# Altium project AJAXProject.PrjPcb
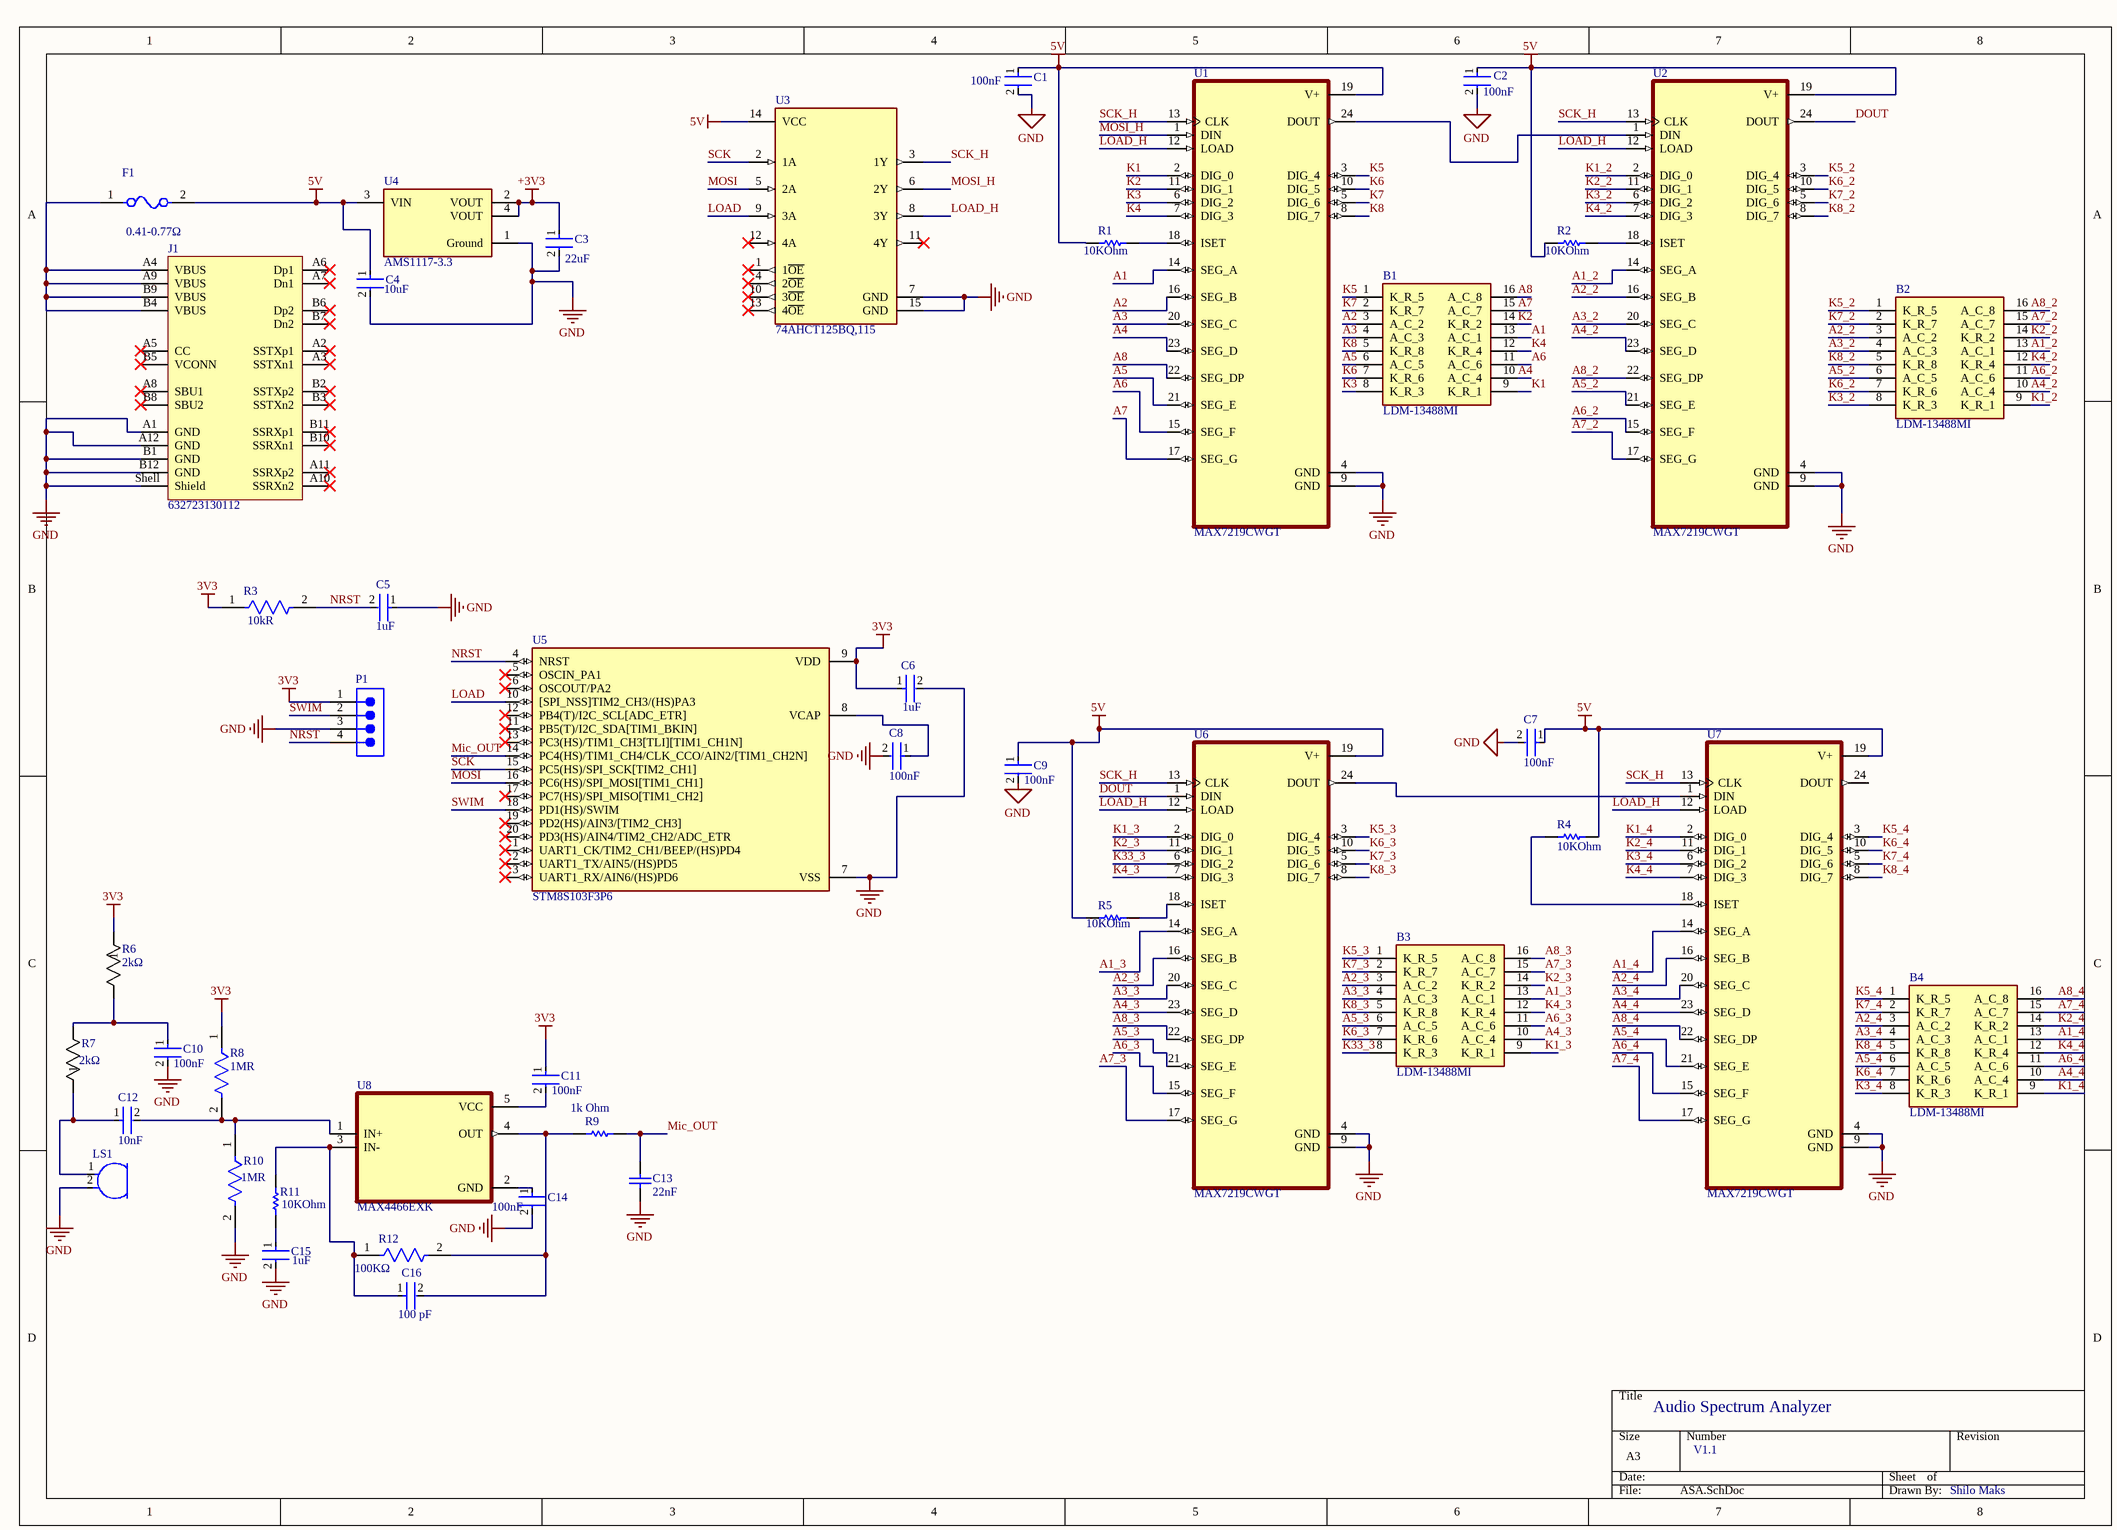
[diagram p0: ASA.SchDoc]
1 sheet, 44 parts. Net scope: global (net labels, ports and power ports of the same name join across sheets).

## Sheet ASA.SchDoc
size A3; SheetNumber: 1; SheetTotal: 1

### Parts
B1  LDM-13488MI  [LDM13488MI]
B2  LDM-13488MI  [LDM13488MI]
B3  LDM-13488MI  [LDM13488MI]
B4  LDM-13488MI  [LDM13488MI]
C1  Capacitance: 100nF  [FP-1206-L_3_2_0_15-W_1_6-IPC_A]  (hidden comment: HMK316B7104ML-T)
C2  Capacitance: 100nF  [FP-1206-L_3_2_0_15-W_1_6-IPC_A]  (hidden comment: HMK316B7104ML-T)
C3  Capacitance: 22uF  [FP-CC0603-DC-MFG]  (hidden comment: CC0603MRX5R5BB226)
C4  Capacitance: 10uF  [FP-CL21-IPC_C]  (hidden comment: CL21A106MPFNNNF)
C5  Capacitance: 1uF  [FP-CL21-IPC_B]  (hidden comment: CL21F105ZAFNNNF)
C6  Capacitance: 1uF  [FP-CL21-IPC_B]  (hidden comment: CL21F105ZAFNNNF)
C7  Capacitance: 100nF  [FP-1206-L_3_2_0_15-W_1_6-IPC_A]  (hidden comment: HMK316B7104ML-T)
C8  Capacitance: 100nF  [FP-1206-L_3_2_0_15-W_1_6-IPC_A]  (hidden comment: HMK316B7104ML-T)
C9  Capacitance: 100nF  [FP-1206-L_3_2_0_15-W_1_6-IPC_A]  (hidden comment: HMK316B7104ML-T)
C10  Capacitance: 100nF  [FP-1206-L_3_2_0_15-W_1_6-IPC_A]  (hidden comment: HMK316B7104ML-T)
C11  Capacitance: 100nF  [FP-1206-L_3_2_0_15-W_1_6-IPC_A]  (hidden comment: HMK316B7104ML-T)
C12  Capacitance: 10nF  [FP-CGA3E-0_3-0_1-IPC_A]  (hidden comment: CGA3E2X8R2A103K080AD)
C13  22nF  [CAPC1608X92X38NL15T08]
C14  Capacitance: 100nF  [FP-1206-L_3_2_0_15-W_1_6-IPC_A]  (hidden comment: HMK316B7104ML-T)
C15  Capacitance: 1uF  [FP-CL21-IPC_B]  (hidden comment: CL21F105ZAFNNNF)
C16  Capacitance: 100 pF  [FP-C0402-BB-MFG]  (hidden comment: C0402C101K5GACTU)
F1  Resistance: 0.41-0.77Ω  [FP-MF-R050-MFG]  (hidden comment: MF-R050)
J1  632723130112  [632723130112]
LS1  POM-2738P-R  [FP-POM-2738P-R-MFG]  (value not drawn)
P1  61300411021  [61300411021]  (value not drawn)
R1  value 10KOhm  [RESC1206(3216)_M]  (hidden comment: 10K 5% 1206(3216))
R2  value 10KOhm  [RESC1206(3216)_M]  (hidden comment: 10K 5% 1206(3216))
R3  Resistance: 10kR  [FP-CR2010-IPC_C]  (hidden comment: CR2010-JW-103ELF)
R4  value 10KOhm  [RESC1206(3216)_M]  (hidden comment: 10K 5% 1206(3216))
R5  value 10KOhm  [RESC1206(3216)_M]  (hidden comment: 10K 5% 1206(3216))
R6  Resistance: 2kΩ  [MCA 1206_VIS]  (hidden comment: MCA12060D2001BP100)
R7  Resistance: 2kΩ  [MCA 1206_VIS]  (hidden comment: MCA12060D2001BP100)
R8  Resistance: 1MR  [FP-CRCW0603-HPe3-IPC_A]  (hidden comment: CRCW06031M00JNEAHP)
R9  value 1k Ohm  [RESC2010(5025)_L]  (hidden comment: 1K 5% 2010(5025))
R10  Resistance: 1MR  [FP-CRCW0603-HPe3-IPC_A]  (hidden comment: CRCW06031M00JNEAHP)
R11  value 10KOhm  [RESC1206(3216)_M]  (hidden comment: 10K 5% 1206(3216))
R12  Resistance: 100KΩ  [FP-RT1206-MFG]  (hidden comment: RT1206DRE07100KL)
U1  MAX7219CWGT  [SOIC127P1032X265-24N]
U2  MAX7219CWGT  [SOIC127P1032X265-24N]
U3  74AHCT125BQ,115  [FP-SOT762-1-MFG]
U4  AMS1117-3.3  [FP-AMS1117-IPC_C]
U5  STM8S103F3P6  [SOP65P640X120-20N]
U6  MAX7219CWGT  [SOIC127P1032X265-24N]
U7  MAX7219CWGT  [SOIC127P1032X265-24N]
U8  MAX4466EXK  [SOT65P210X110-5N]

### Nets
3V3: C6.1 C11.1 P1.1 R3.1 R6.1 R8.1 U5.9(VDD)
5V: C1.1 C2.1 C4.1 C7.1 C9.1 F1.2 R1.2 R2.2 R4.1 R5.2 U1.19(V+) U2.19(V+) U3.14(VCC) U4.3(VIN) U6.19(V+) U7.19(V+)
+3V3: C3.1 U4.2(VOUT) U4.4(VOUT)
GND: C1.2 C2.2 C3.2 C4.2 C5.1 C6.2 C7.2 C8.2 C9.2 C10.2 C13.1 C14.2 C15.2 J1.A1(GND) J1.A12(GND) J1.B1(GND) J1.B12(GND) J1.Shell(Shield) LS1.2(C) P1.3 R10.2 U1.4(GND) U1.9(GND) U2.4(GND) U2.9(GND) U3.7(GND) U3.15(GND) U4.1(Ground) U5.7(VSS) U6.4(GND) U6.9(GND) U7.4(GND) U7.9(GND)
DOUT: U2.24(DOUT) U6.1(DIN)
K1: B1.9(K_R_1) U1.2(DIG_0)
K1_2: B2.9(K_R_1) U2.2(DIG_0)
K1_3: B3.9(K_R_1) U6.2(DIG_0)
K1_4: B4.9(K_R_1) U7.2(DIG_0)
K2: B1.14(K_R_2) U1.11(DIG_1)
K2_2: B2.14(K_R_2) U2.11(DIG_1)
K2_3: B3.14(K_R_2) U6.11(DIG_1)
K2_4: B4.14(K_R_2) U7.11(DIG_1)
K3: B1.8(K_R_3) U1.6(DIG_2)
K3_2: B2.8(K_R_3) U2.6(DIG_2)
K3_4: B4.8(K_R_3) U7.6(DIG_2)
K4: B1.12(K_R_4) U1.7(DIG_3)
K4_2: B2.12(K_R_4) U2.7(DIG_3)
K4_3: B3.12(K_R_4) U6.7(DIG_3)
K4_4: B4.12(K_R_4) U7.7(DIG_3)
K5: B1.1(K_R_5) U1.3(DIG_4)
K5_2: B2.1(K_R_5) U2.3(DIG_4)
K5_3: B3.1(K_R_5) U6.3(DIG_4)
K5_4: B4.1(K_R_5) U7.3(DIG_4)
K6: B1.7(K_R_6) U1.10(DIG_5)
K6_2: B2.7(K_R_6) U2.10(DIG_5)
K6_3: B3.7(K_R_6) U6.10(DIG_5)
K6_4: B4.7(K_R_6) U7.10(DIG_5)
K7: B1.2(K_R_7) U1.5(DIG_6)
K7_2: B2.2(K_R_7) U2.5(DIG_6)
K7_3: B3.2(K_R_7) U6.5(DIG_6)
K7_4: B4.2(K_R_7) U7.5(DIG_6)
K8: B1.5(K_R_8) U1.8(DIG_7)
K8_2: B2.5(K_R_8) U2.8(DIG_7)
K8_3: B3.5(K_R_8) U6.8(DIG_7)
K8_4: B4.5(K_R_8) U7.8(DIG_7)
K33_3: B3.8(K_R_3) U6.6(DIG_2)
LOAD: U3.9(3A) U5.10([SPI_NSS]TIM2_CH3/(HS)PA3)
LOAD_H: U1.12(LOAD) U2.12(LOAD) U3.8(3Y) U6.12(LOAD) U7.12(LOAD)
Mic_OUT: C13.2 R9.2 U5.14(PC4(HS)/TIM1_CH4/CLK_CCO/AIN2/[TIM1_CH2N])
MOSI: U3.5(2A) U5.16(PC6(HS)/SPI_MOSI[TIM1_CH1])
MOSI_H: U1.1(DIN) U3.6(2Y)
NRST: C5.2 P1.4 R3.2 U5.4(NRST)
SCK: U3.2(1A) U5.15(PC5(HS)/SPI_SCK[TIM2_CH1])
SCK_H: U1.13(CLK) U2.13(CLK) U3.3(1Y) U6.13(CLK) U7.13(CLK)
SWIM: P1.2 U5.18(PD1(HS)/SWIM)
А1: B1.13(A_C_1) U1.14(SEG_A)
А1_2: B2.13(A_C_1) U2.14(SEG_A)
А1_3: B3.13(A_C_1) U6.14(SEG_A)
А1_4: B4.13(A_C_1) U7.14(SEG_A)
А2: B1.3(A_C_2) U1.16(SEG_B)
А2_2: B2.3(A_C_2) U2.16(SEG_B)
А2_3: B3.3(A_C_2) U6.16(SEG_B)
А2_4: B4.3(A_C_2) U7.16(SEG_B)
А3: B1.4(A_C_3) U1.20(SEG_C)
А3_2: B2.4(A_C_3) U2.20(SEG_C)
А3_3: B3.4(A_C_3) U6.20(SEG_C)
А3_4: B4.4(A_C_3) U7.20(SEG_C)
А4: B1.10(A_C_4) U1.23(SEG_D)
А4_2: B2.10(A_C_4) U2.23(SEG_D)
А4_3: B3.10(A_C_4) U6.23(SEG_D)
А4_4: B4.10(A_C_4) U7.23(SEG_D)
А5: B1.6(A_C_5) U1.21(SEG_E)
А5_2: B2.6(A_C_5) U2.21(SEG_E)
А5_3: B3.6(A_C_5) U6.21(SEG_E)
А5_4: B4.6(A_C_5) U7.21(SEG_E)
А6: B1.11(A_C_6) U1.15(SEG_F)
А6_2: B2.11(A_C_6) U2.15(SEG_F)
А6_3: B3.11(A_C_6) U6.15(SEG_F)
А6_4: B4.11(A_C_6) U7.15(SEG_F)
А7: B1.15(A_C_7) U1.17(SEG_G)
А7_2: B2.15(A_C_7) U2.17(SEG_G)
А7_3: B3.15(A_C_7) U6.17(SEG_G)
А7_4: B4.15(A_C_7) U7.17(SEG_G)
А8: B1.16(A_C_8) U1.22(SEG_DP)
А8_2: B2.16(A_C_8) U2.22(SEG_DP)
А8_3: B3.16(A_C_8) U6.22(SEG_DP)
А8_4: B4.16(A_C_8) U7.22(SEG_DP)
NetC8_1: C8.1 U5.8(VCAP)
NetC10_1: C10.1 R6.2 R7.2
NetC11_2: C11.2 U8.5(VCC)
NetC12_1: C12.1 LS1.1(A) R7.1
NetC12_2: C12.2 R8.2 R10.1 U8.1(IN+)
NetC14_1: C14.1 U8.2(GND)
NetC15_1: C15.1 R11.1
NetC16_1: C16.1 R11.2 R12.1 U8.3(IN-)
NetC16_2: C16.2 R9.1 R12.2 U8.4(OUT)
NetF1_1: F1.1 J1.A4(VBUS) J1.A9(VBUS) J1.B4(VBUS) J1.B9(VBUS)
NetR1_1: R1.1 U1.18(ISET)
NetR2_1: R2.1 U2.18(ISET)
NetR4_2: R4.2 U7.18(ISET)
NetR5_1: R5.1 U6.18(ISET)
NetU1_24: U1.24(DOUT) U2.1(DIN)
NetU6_24: U6.24(DOUT) U7.1(DIN)

Not connected (* = marked no-connect by the designer): J1 A2(SSTXp1)* A3(SSTXn1)* A5(CC)* A6(Dp1)* A7(Dn1)* A8(SBU1)* A10(SSRXn2)* A11(SSRXp2)* B2(SSTXp2)* B3(SSTXn2)* B5(VCONN)* B6(Dp2)* B7(Dn2)* B8(SBU2)* B10(SSRXn1)* B11(SSRXp1)*; U3 1(1~{OE})* 4(2~{OE})* 10(3~{OE})* 11(4Y)* 12(4A)* 13(4~{OE})*; U5 1(UART1_CK/TIM2_CH1/BEEP/(HS)PD4)* 2(UART1_TX/AIN5/(HS)PD5)* 3(UART1_RX/AIN6/(HS)PD6)* 5(OSCIN_PA1)* 6(OSCOUT/PA2)* 11(PB5(T)/I2C_SDA[TIM1_BKIN])* 12(PB4(T)/I2C_SCL[ADC_ETR])* 13(PC3(HS)/TIM1_CH3[TLI][TIM1_CH1N])* 17(PC7(HS)/SPI_MISO[TIM1_CH2])* 19(PD2(HS)/AIN3/[TIM2_CH3])* 20(PD3(HS)/AIN4/TIM2_CH2/ADC_ETR)*; U7 24(DOUT)

### Notes on the sheet
- Audio Spectrum Analyzer
- V1.1
- Shilo Maks

### Library data of the parts
B1-B4 = LDM-13488MI: LED MATRIX 8X8 1.3" 630NM RED CC; Manufacturer_Name: Lumex; Geometry.Height: 8.25mm; Mouser Part Number: 696-LDM-13488MI; Mouser Price/Stock: https://www.mouser.co.uk/ProductDetail/Lumex/LDM-13488MI?qs=yJopvU1l2pYScS1UPG0ScQ%3D%3D; Manufacturer_Part_Number: LDM-13488MI; Datasheet Link: https://pdf1.alldatasheet.com/datasheet-pdf/view/599219/LUMEX/LDM-13488MI.html
C1 C2 C7-C11 C14 = CMP-14477-001727-2: None; Dielectric: X7R; Voltage Rating (DC): 100V; Tolerance: 20%; Halogen Free: Halogen Free; RoHS Compliant: Yes; Depth: 1.6mm; Max Operating Temperature: 125°C; Series: M; Package Quantity: 2000; Radiation Hardening: No; Voltage Rating: 100V; Number of Pins: 2; Width: 0.063inch; Mount: Surface Mount; Construction: Flat; Case Code (Metric): 3216; Packaging: Tape and Reel; Height: 1.6mm; Min Operating Temperature: -55°C; Case Code (Imperial): 1206; Case/Package: 1206; Weight: 0.000571oz; Resistor Type: Ceramic; Length: 3.2mm; Thickness: 0.071inch; Termination: SMD/SMT
C3 = CMP-2000-06075-2: CAP CER 22UF 6.3V X5R 0603; Tolerance: 20%; Termination: SMD/SMT; Mount: Surface Mount; Depth: 0.8mm; Thickness: 0.035inch; Packaging: Tape and Reel; RoHS Compliant: Yes; Case/Package: 0603; Min Operating Temperature: -55°C; Package Quantity: 4000; Weight: 7.1E-05oz; Max Operating Temperature: 85°C; Voltage Rating (DC): 6.3V; Halogen Free: Halogen Free; Lead Free: Lead Free; Resistor Type: Ceramic; Case Code (Imperial): 0603; Width: 0.031inch; Case Code (Metric): 1608; Voltage Rating: 6.3V; Length: 0.063inch; Dielectric: X5R
C4 = CMP-13271-002245-1: CL21 Series 0805 10uF 10V ±20% Tolerance X5R Multilayer Ceramic Chip Capacitor; Voltage Rating (DC): 10V; Mount: Surface Mount; Tolerance: 20%; Case/Package: 0805; Voltage Rating: 10V; Dielectric: X5R; Max Operating Temperature: 85°C; Packaging: Tape and Reel; Height: 1.25mm; Thickness: 0.053inch; Width: 0.049inch; Length: 2mm; Radiation Hardening: No; Min Operating Temperature: -55°C; Depth: 1.25mm; Package Quantity: 10000
C5 C6 C15 = CMP-13271-002018-1: CL21 Series 0805 1uF 25V -20/+80% Tolerance Y5V Multilayer Ceramic Chip Capacitor; Tolerance: 80%; Voltage Rating: 25V; Voltage Rating (DC): 25V; Thickness: 0.053inch; Radiation Hardening: No; Width: 0.049inch; Height: 1.25mm; Max Operating Temperature: 85°C; Mount: Surface Mount; Package Quantity: 10000; Depth: 1.25mm; Min Operating Temperature: -30°C; Packaging: Tape and Reel; Case/Package: 0805; Length: 2mm; Dielectric: Y5V
C12 = CMP-08246-000769-1: Cap Ceramic 10nF 100V X8R 10% Pad SMD 0603 +150°C Automotive T/R; Mount: Surface Mount; Voltage Rating (DC): 100V; Termination: SMD/SMT; Dielectric: X8R; Case/Package: 0603; Ratings: AEC-Q200; Voltage Rating: 100V; Packaging: Tape and Reel; Thickness: 0.035inch; Composition: Ceramic; Max Operating Temperature: 150°C; Width: 0.031inch; Height: 0.8mm; Weight: 7.1E-05oz; Depth: 0.8mm; Min Operating Temperature: -55°C; Length: 1.6mm; Case Code (Metric): 1608; Tolerance: 10%; Package Quantity: 4000; Case Code (Imperial): 0603
C13 = CMP-2006-01144-1: Manufacturer: Vitramon; Part Number: VJ0603Y223KXAAC
C16 = CMP-2008-03050-3: CAP CER 100PF 50V 10% NP0 0402; Manufacturer: Kemet; Tolerance: 0.1; Temperature Coefficient: 15%; Temperature Characteristic: C0G; Material: Ceramic; Automotive: No; Temperature Range High: +125°C; Device Class L3: Ceramic Capacitors; ComponentLink2Description: Datasheet; Temperature Range Low: -55°C; Height: 0.55mm; Manufacturer Part Number: C0402C101K5GACTU; Package: C0402-BB; Digikey Description: CAP CER 100PF 50V 10% NP0 0402; RoHS: TRUE; Mouser Description: KEMET - C0402C101K5GACTU - CAP, C0G / NP0, 100PF, 50V, 0402; ComponentLink2URL: https://content.kemet.com/datasheets/KEM_C1002_X7R_SMD.pdf; Value: 100 pF; Category: Cap; Device Class L1: Passive Components; Octopart: https://octopart.com/c0402c101k5gactu-kemet-9144183; Device Class L2: Capacitors; Ipc Land Pattern Name: CAPC10050X50; Temperature: -55°C to +125°C; Voltage Rating: 50 V; Lead Free: Yes
F1 = CMP-07400-000037-1: PTC RESET FUSE 60V 500MA RADIAL; Manufacturer: Bourns; Current Rating: 40A; Trip Time: 4s; Value: 0.41-0.77Ω; Trip Current: 1A; Hold Current: 0.5A; Automotive: No; Device Class L1: Circuit Protection; Ambient Temperature Range Low: -40°C; Height: 13.7mm; Category: Fuse; ComponentLink2Description: Datasheet; Device Class L3: unset; Mouser Description: PTC Resettable Fuse 0.5A(hold) 1A(trip) 60V 40A 0.75W 4s 0.41Ohm Radial 7.9 X 3.1mm Bulk; RoHS: TRUE; Temperature Range High: +85°C; Octopart: https://octopart.com/mf-r050-bourns-19418; Temperature Range Low: -40°C; Device Class L2: PTC Resettable Fuses; Package: MF-R050; Manufacturer Part Number: MF-R050; Temperature: -40°C to +85°C; Ambient Temperature Range High: +85°C; ComponentLink2URL: https://upverter.com/datasheet/a1b715b2a3574ae967878e49fe70c2811aecae4b.pdf; Digikey Description: PTC RESET FUSE 60V 500MA RADIAL; Lead Free: Yes; Voltage Rating: 60V
J1 = CMP-207978-000001-2: WR-COM_USB 3.1_TYPE C_HORIZONTAL; NexarPartId: 99674471; Insulation Resistance: 100MΩ; USB Standard: USB 3.1; Number of Contacts: 24; Current Rating: 5A; Voltage Rating: 20V; Gender: Receptacle; Max Operating Temperature: 85°C; Height: 3.52mm; Min Operating Temperature: -40°C; Number of Pins: 24; Contact Material: Gold, Nickel; Packaging: Tape and Reel; RoHS: Compliant
LS1 = CMP-103887-000001-1: MIC COND ANALOG OMNI -38DB; Manufacturer: PUI Audio, Inc.; Current: 0.5mA; Direction: Omidirectional; Value: 2.2kΩ; Operating Supply Voltage: 2V; Max Supply Voltage: 10V; Package: 0; Device Class L3: Microphones; Device Class L2: Audio Products; Octopart: https://octopart.com/pom-2738p-r-pui+audio-19251807; Manufacturer Part Number: POM-2738P-R; Height: 2.9mm; Mouser Description: Mic Omni-Directional 2200Ohm -38±3dB 10Vdc Round Pin; Lead Free: Yes; Automotive: No; RoHS: TRUE; ComponentLink2Description: Datasheet; Category: Speak; Device Class L1: Electromechanical; Digikey Description: MIC COND ANALOG OMNI -38DB; ComponentLink2URL: http://www.puiaudio.com/pdf/POM-2738P-R.pdf; Resistance: 2.2kΩ
P1 = CMP-1502-01063-3: NexarPartId: 31153320; Current Rating: 3A; Number of Contacts: 4; Gender: Male; Operating Supply Voltage: 250V; Contact Resistance: 20mΩ; Connector Type: Male Pin; Pitch: 2.54mm; Contact Material: Copper; Number of Positions: 4; Color: Black; Contact Plating: Gold; Number of Pins: 4; Termination: Solder; Number of Rows: 1; Lead Pitch: 2.54mm; Mount: Through Hole; Contact Mating Length: 5.9944mm; RoHS: Compliant; REACH SVHC: Unknown
R1 R2 R4 R5 R11 = CMP-1014-00098-1: 10K 0.25W 5% 1206 (3216 Metric)  SMD; Case-Metric: 3216; Case-EIA: 1206; Power: 0.25 W; Tolerance: 5 %; Technology: SMT
R3 = CMP-07231-003456-1: Thick Film Chip Resistors 2010 10kΩ 0.5W 5% 200ppm/°C; Voltage Rating: 200V; Power Rating: 500mW; Tolerance: 5%; Contact Plating: Tin; Length: 5mm; Case/Package: 2010; Package Quantity: 4000; Max Operating Temperature: 155°C; Case Code (Imperial): 2010; Mount: Surface Mount; Case Code (Metric): 5025; Width: 2.5mm; Temperature Coefficient: 200ppm/°C; Packaging: Tape and Reel; Height: 0.6mm; Radiation Hardening: No; Composition: Thick Film; Min Operating Temperature: -55°C; Termination: SMD/SMT
R6 R7 = CMP-00030-45006308-1: MCA12060D2001BP100 SMD Chip Resistor, 2 kOhm, ± 0.1%, 250 mW, 1206 [3216 Metric], Thin Film, Precision; Max Power Dissipation: 250mW; Temperature Coefficient: 25ppm/°C; Voltage Rating: 200V; Case/Package: 1206; Length: 3.2004mm; NexarPartId: 45006308; Composition: Thin Film; Number of Terminations: 2; Power Rating: 250mW; Max Operating Temperature: 125°C; Contact Plating: Tin; Height: 650µm; Packaging: Tape & Reel (TR); Lead Free: Lead Free; RoHS: Compliant; Width: 1.6002mm; Tolerance: 0.1%; Radiation Hardening: No; Min Operating Temperature: -55°C
R8 R10 = CMP-02407-009732-1: RES Thick Film, 1MΩ, 5%, 0.33W, 200ppm/°C, 0603; Max Power Dissipation: 250mW; Voltage Rating: 75V; Case Code (Imperial): 0603; Radiation Hardening: No; Length: 0.063inch; Tolerance: 5%; Features: Automotive AEC-Q200; Number of Terminations: 2; Height: 0.022inch; Max Operating Temperature: 155°C; Lead Free: Lead Free; Packaging: Tape and Reel; Case/Package: 0603; Weight: 7.1E-05oz; Width: 0.8mm; Min Operating Temperature: -55°C; Termination: SMD/SMT; Package Quantity: 1; Case Code (Metric): 1608; Composition: Thick Film; Temperature Coefficient: 200ppm/°C; Power Rating: 250mW; Contact Plating: Tin
R9 = CMP-1017-00074-1: 1K 0.75W 5% 2010 (5025 Metric)  SMD; Case-EIA: 2010; Case-Metric: 5025; Technology: SMT; Tolerance: 5 %; Power: 0.75 W
R12 = CMP-2003-04271-2: RES SMD 100K OHM 0.5% 1/4W 1206; Manufacturer: Yageo; Value: 100KΩ; Power Rating: 0.25W; Tolerance: 0.0001; Temperature Coefficient: 50 ppm/°C; Voltage Rating: 200V; Mouser Description: Res Thin Film 1206 100K Ohm 0.5% 1/4W ±50ppm/°C Molded SMD Paper T/R; Series: RT; RoHS: TRUE; Device Class L3: Chip SMD Resistors; Ipc Land Pattern Name: RESC310160X55; Lead Free: Yes; Package: RT1206; Height: 0.65mm; Composition: Thin Film; Temperature Range Low: -55°C; Device Class L2: Resistors; Octopart: https://octopart.com/rt1206dre07100kl-yageo-1189867; ComponentLink2Description: Datasheet; ComponentLink2URL: http://www.yageo.com/documents/recent/PYu-RT_1-to-0.01_RoHS_L_9.pdf; Digikey Description: RES SMD 100K OHM 0.5% 1/4W 1206; Manufacturer Part Number: RT1206DRE07100KL; Temperature Range High: +155°C; Automotive: No; Temperature: -55°C to +155°C; Device Class L1: Passive Components; Footprint Url: http://www.yageo.com/exep/pages/download/literatures/PYu-R_Mount_10.pdf; Category: Res
U1 U2 U6 U7 = MAX7219CWGT: IC DRVR 7 SEGMNT 8 DIGIT 24SOIC; MF: Analog Devices; MP: MAX7219CWG+; SnapEDA_Link: https://www.snapeda.com/parts/MAX7219CWG+/Analog+Devices/view-part/?ref=snap; Package: SOIC-24 Maxim; Value: *; Check_prices: https://www.snapeda.com/parts/MAX7219CWG+/Analog+Devices/view-part/?ref=eda
U3 = CMP-14350-000006-1: IC BUFF NON-INVERT 5.5V 14DHVQFN
U4 = CMP-209535-000001-1: LDO Voltage Regulators 1A, 3.3V; Manufacturer: Advanced Monolithic Systems; Dropout Voltage: 1.1V; Output Type: Fixed; Nominal Supply Current: 5mA; Max Power Dissipation: 1.2W; Max Supply Voltage: 15V; Number Of Outputs: 1; Standoff Height: 0.64mm; Max Junction Temp: +125°C; Height: 1.8mm; Package: AMS1117; Device Class L2: Power Management ICs; ComponentLink2Description: Datasheet; ComponentLink2URL: http://www.advanced-monolithic.com/pdf/ds1117.pdf; Category: IC; RoHS: TRUE; Automotive: No; Device Class L1: Integrated Circuits (ICs); Output Current: 1A; Device Class L3: Voltage Regulators - Linear; Temperature: -40°C to +125°C; Output Voltage: 3.3V; Manufacturer Part Number: AMS1117-3.3; Temperature Range Low: -40°C; Octopart: https://octopart.com/ams1117-3.3-advanced+monolithic+systems-25899300; Lead Free: Yes; Ipc Land Pattern Name: SOT229P700X180-4; Temperature Range High: +125°C
U5 = STM8S103F3P6: STM8 series Microcontroller IC 8-Bit 16MHz 8KB (8K x 8) FLASH 20-TSSOP; MF: STMicroelectronics; SnapEDA_Link: https://www.snapeda.com/parts/STM8S103F3P6/STMicroelectronics/view-part/?ref=snap; Package: TSSOP-20 STMicroelectronics; Value: *; MP: STM8S103F3P6; Check_prices: https://www.snapeda.com/parts/STM8S103F3P6/STMicroelectronics/view-part/?ref=eda
U8 = MAX4466EXK: Audio Amp Microphone 1-CH Mono Class-AB 5-Pin SC-70 T/R; MF: Analog Devices; MP: MAX4466EXK+T; SnapEDA_Link: https://www.snapeda.com/parts/MAX4466EXK+T/Analog+Devices/view-part/?ref=snap; Package: SC-70-5 Maxim; Value: *; Check_prices: https://www.snapeda.com/parts/MAX4466EXK+T/Analog+Devices/view-part/?ref=eda